# Altium schematic sheet Main.SchDoc
size A3; SheetNumber: 1
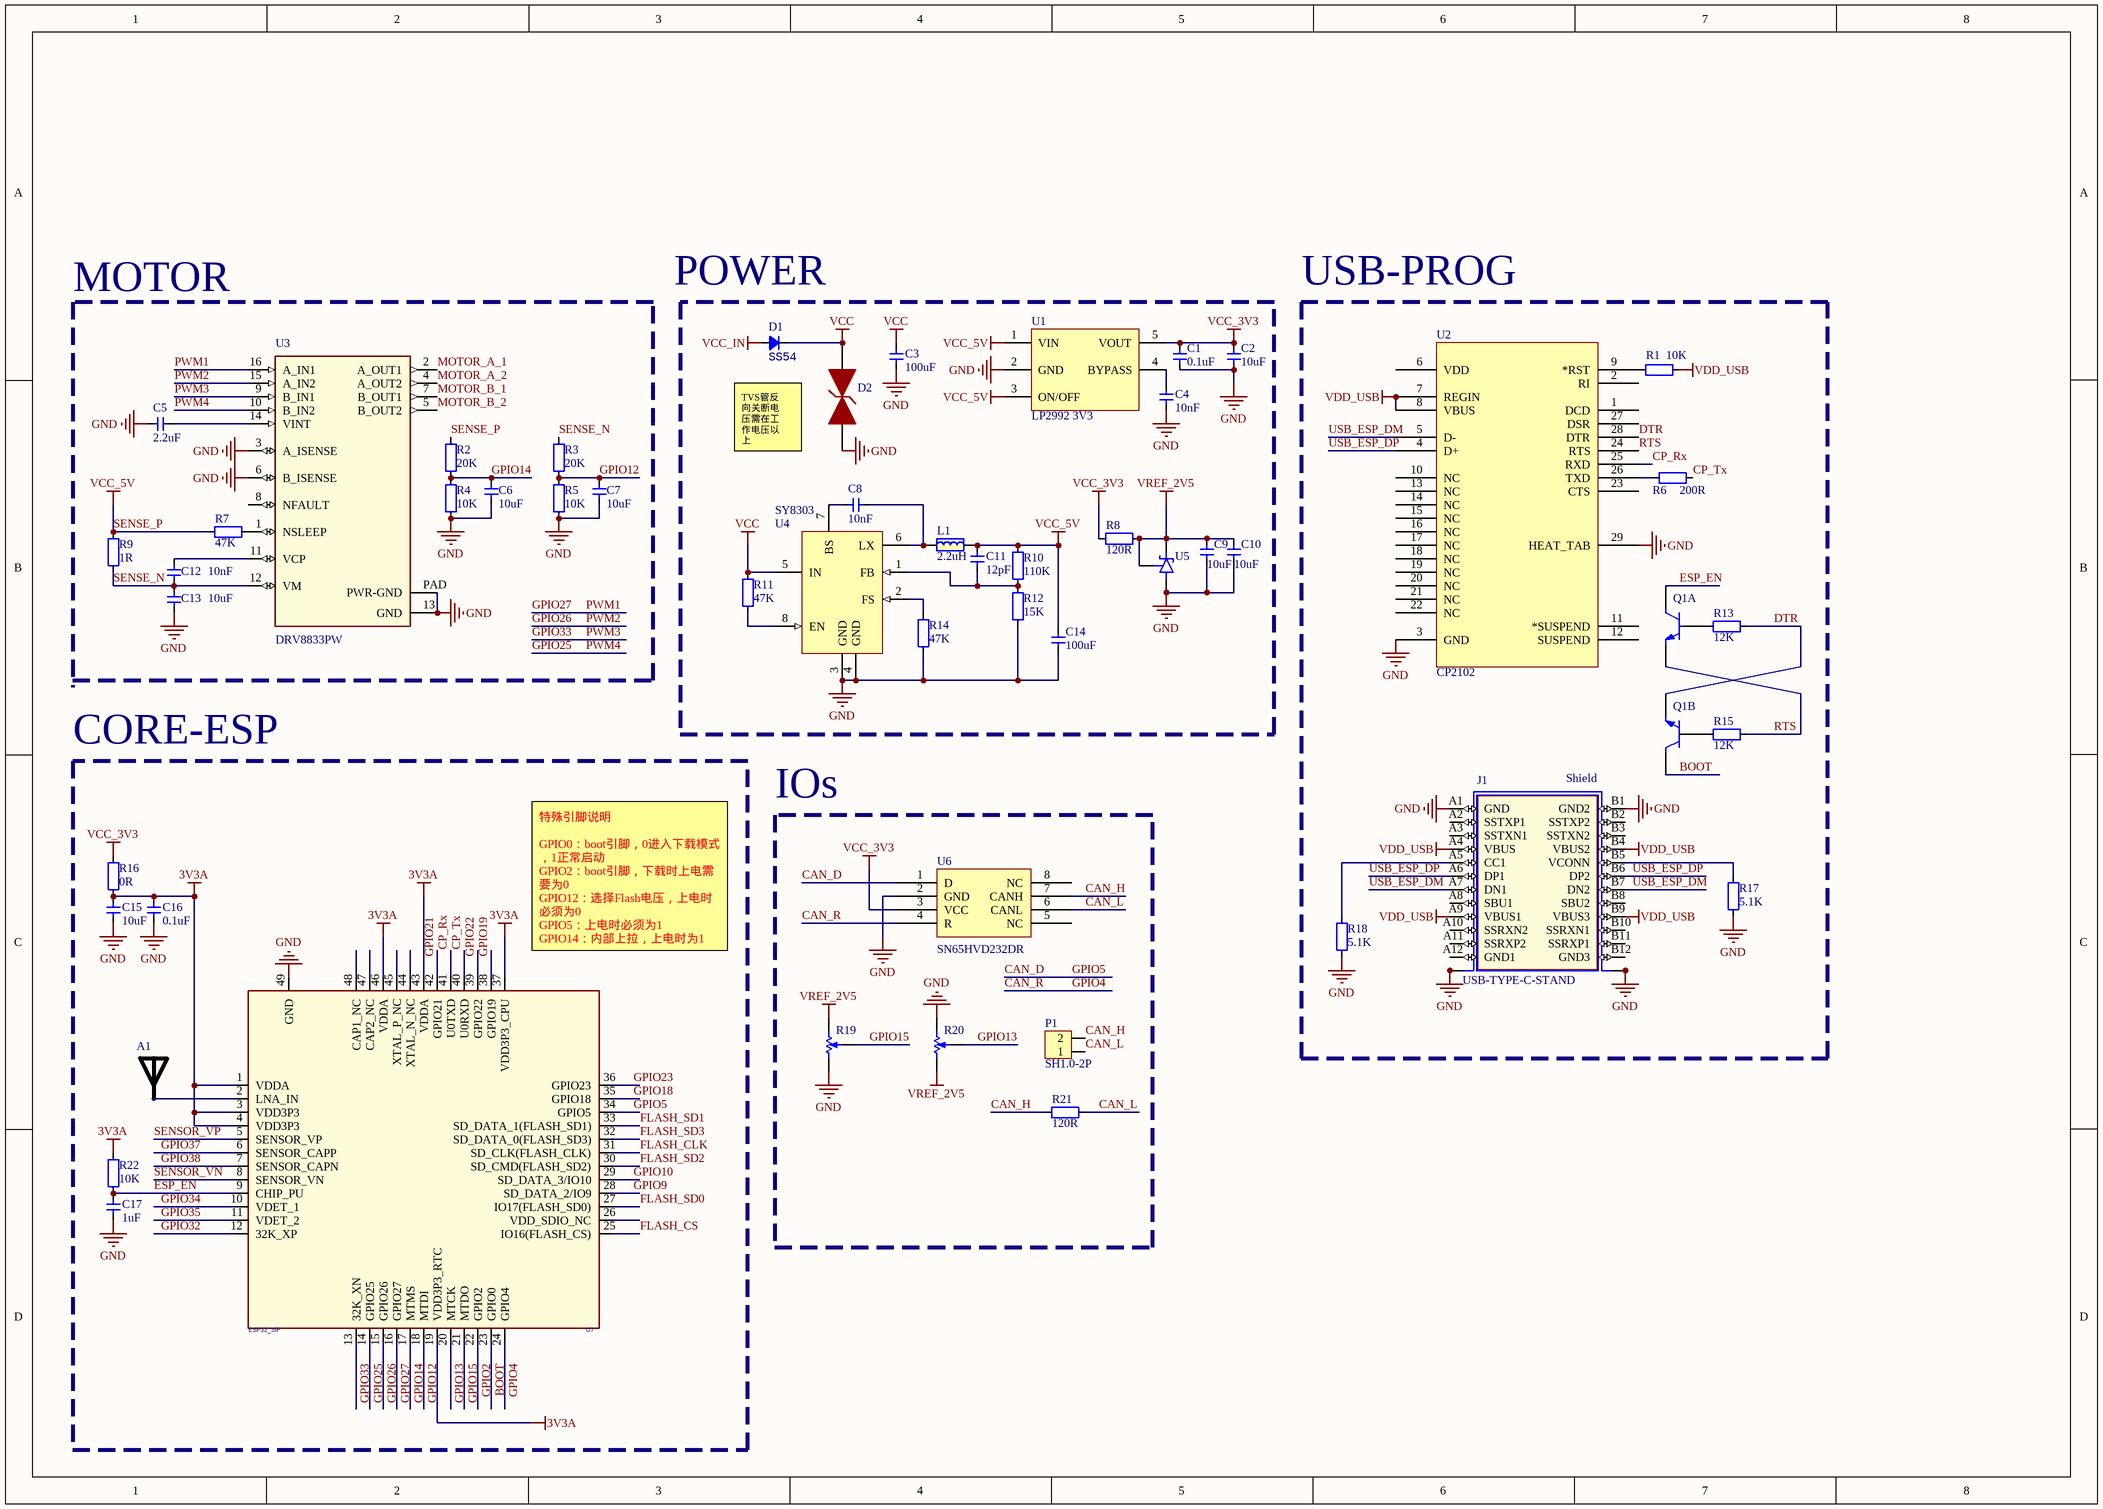
[diagram p0: Main.SchDoc]

## Parts
A1  RAINSUN  [ANT-Rainsun-AN5120]  (value not drawn)
C1  0.1uF  [CAP_0402]
C2  10uF  [CAP_0402]
C3  100uF  [1206-CAP]
C4  10nF  [CAP_0402]
C5  2.2uF  [CAP_0402]
C6  10uF  [CAP_0402]
C7  10uF  [CAP_0402]
C8  10nF  [CAP_0402]
C9  10uF  [CAP_0402]
C10  10uF  [CAP_0402]
C11  12pF  [CAP_0402]
C12  10nF  [CAP_0402]
C13  10uF  [CAP_0402]
C14  100uF  [CAP_0402]
C15  10uF  [CAP_0402]
C16  0.1uF  [CAP_0402]
C17  1uF  [CAP_0402]
D1  SS54  [DO-214AC]
D2  SMBJ28CA  [SMBJ-CA_MFG]  (value not drawn)
J1  USB-TYPE-C-STAND  [USB-TYPE-C-STAND]
L1  2.2uH  [IND_CD74]
P1  SH1.0-2P  [SH1.0-2P]
Q1  BC847BVC-7  [SOT563-6]  (value not drawn)  (parts A,B of 2)
R1  10K  [RES_0402]
R2  20K  [RES_0402]
R3  20K  [RES_0402]
R4  10K  [RES_0402]
R5  10K  [RES_0402]
R6  200R  [RES_0402]
R7  47K  [RES_0402]
R8  120R  [RES_0402]
R9  1R  [1206-RES]
R10  110K  [RES_0402]
R11  47K  [RES_0402]
R12  15K  [RES_0402]
R13  12K  [RES_0402]
R14  47K  [RES_0402]
R15  12K  [RES_0402]
R16  0R  [RES_0402]
R17  5.1K  [RES_0402]
R18  5.1K  [RES_0402]
R19  ALPS-角度传感器  [ALPS-角度传感器]  (value not drawn)
R20  ALPS-角度传感器  [ALPS-角度传感器]  (value not drawn)
R21  120R  [RES_0402]
R22  10K  [RES_0402]
U1  LP2992 3V3  [SOT23-5]
U2  CP2102  [QFN-28]
U3  DRV8833PW  [TSSOP-16]
U4  SY8303  [SOT23-8]
U5  TL431IDBZT  [SOT23-3]  (value not drawn)
U6  Manufacturer Part Number: SN65HVD232DR  [SO-8]  (hidden comment: SN65HVD232D)
U7  ESP32_SIP  [QFN-48_7X7]

## Blocks framed on the sheet
USB-PROG: J1 Q1 R1 R6 R13 R15 R17 R18 U2
CORE-ESP: A1 C15-C17 R16 R22 U7
IOs: P1 R19-R21 U6

## Nets
3V3A: C15.2 C16.2 R16.2 R22.1 U7.1(VDDA) U7.3(VDD3P3) U7.4(VDD3P3) U7.19(VDD3P3_RTC) U7.37(VDD3P3_CPU) U7.43(VDDA) U7.46(VDDA)
GND: C1.1 C2.1 C3.1 C4.1 C5.1 C6.1 C7.1 C9.1 C10.1 C13.1 C14.1 C15.1 C16.1 C17.2 D2.1 J1.A1(GND) J1.B1(GND2) J1.S1(SHIELD) J1.S2(SHIELD) J1.S3(SHIELD1) J1.S4(SHIELD1) R4.1 R5.1 R12.2 R14.2 R17.2 R18.2 R19.1(-) R20.3(+) U1.2(GND) U2.3(GND) U2.29(HEAT_TAB) U3.3(A_ISENSE) U3.6(B_ISENSE) U3.13(GND) U3.PAD(PWR-GND) U4.3(GND) U4.4(GND) U5.3(ANODE) U6.2(GND) U7.49(GND)
SENSE_P: C11.1 C14.2 L1.2 R2.2 R7.2 R9.2 R10.1 U1.1(VIN) U1.3(ON/OFF)  [also labelled VCC_5V]
VCC: C3.2 D1.2(K) D2.2 R11.1 U4.5(IN)
VCC_3V3: C1.2 C2.2 R8.1 R16.1 U1.5(VOUT) U6.3(VCC)
VCC_IN: D1.1(A)
VDD_USB: J1.A4(VBUS) J1.A9(VBUS1) J1.B4(VBUS2) J1.B9(VBUS3) R1.1 U2.7(REGIN) U2.8(VBUS)
VREF_2V5: C9.2 C10.2 R8.2 R19.3(+) R20.1(-) U5.1(CATHODE) U5.2(REF)
BOOT: Q1.3(C2) U7.23(GPIO0)
CAN_D: U6.1(D) U7.34(GPIO5)  [also labelled GPIO5]
CAN_H: P1.2 R21.2 U6.7(CANH)
CAN_L: P1.1 R21.1 U6.6(CANL)
CAN_R: U6.4(R) U7.24(GPIO4)  [also labelled GPIO4]
CP_Rx: U2.25(RXD) U7.41(U0TXD)
CP_Tx: R6.1 U7.40(U0RXD)
DTR: Q1.4(E2) R13.1 U2.28(DTR)
ESP_EN: C17.1 Q1.6(C1) R22.2 U7.9(CHIP_PU)
FLASH_CLK: U7.31(SD_CLK(FLASH_CLK))
FLASH_CS: U7.25(IO16(FLASH_CS))
FLASH_SD0: U7.27(IO17(FLASH_SD0))
FLASH_SD1: U7.33(SD_DATA_1(FLASH_SD1))
FLASH_SD2: U7.30(SD_CMD(FLASH_SD2))
FLASH_SD3: U7.32(SD_DATA_0(FLASH_SD3))
GPIO2: U7.22(GPIO2)
GPIO9: U7.28(SD_DATA_2/IO9)
GPIO10: U7.29(SD_DATA_3/IO10)
GPIO12: C7.2 R3.1 R5.2 U7.18(MTDI)
GPIO13: R20.2(W) U7.20(MTCK)
GPIO14: C6.2 R2.1 R4.2 U7.17(MTMS)
GPIO15: R19.2(W) U7.21(MTDO)
GPIO18: U7.35(GPIO18)
GPIO19: U7.38(GPIO19)
GPIO21: U7.42(GPIO21)
GPIO22: U7.39(GPIO22)
GPIO23: U7.36(GPIO23)
GPIO25: U3.10(B_IN2) U7.14(GPIO25)  [also labelled PWM4]
GPIO26: U3.15(A_IN2) U7.15(GPIO26)  [also labelled PWM2]
GPIO27: U3.16(A_IN1) U7.16(GPIO27)  [also labelled PWM1]
GPIO32: U7.12(32K_XP)
GPIO33: U3.9(B_IN1) U7.13(32K_XN)  [also labelled PWM3]
GPIO34: U7.10(VDET_1)
GPIO35: U7.11(VDET_2)
GPIO37: U7.6(SENSOR_CAPP)
GPIO38: U7.7(SENSOR_CAPN)
MOTOR_A_1: U3.2(A_OUT1)
MOTOR_A_2: U3.4(A_OUT2)
MOTOR_B_1: U3.7(B_OUT1)
MOTOR_B_2: U3.5(B_OUT2)
RTS: Q1.1(E1) R15.1 U2.24(RTS)
SENSE_N: C12.1 C13.2 R3.2 R9.1 U3.12(VM)
SENSOR_VN: U7.8(SENSOR_VN)
SENSOR_VP: U7.5(SENSOR_VP)
USB_ESP_DM: J1.A7(DN1) J1.B7(DN2) U2.5(D-)
USB_ESP_DP: J1.A6(DP1) J1.B6(DP2) U2.4(D+)
NetA1_1: A1.1 U7.2(LNA_IN)
NetC4_2: C4.2 U1.4(BYPASS)
NetC5_2: C5.2 U3.14(VINT)
NetC8_1: C8.1 L1.1 U4.6(LX)
NetC8_2: C8.2 U4.7(BS)
NetC11_2: C11.2 R10.2 R12.1 U4.1(FB)
NetC12_2: C12.2 U3.11(VCP)
NetJ1_A5: J1.A5(CC1) R18.1
NetJ1_B5: J1.B5(VCONN) R17.1
NetQ1_2: Q1.2(B1) R13.2
NetQ1_5: Q1.5(B2) R15.2
NetR1_2: R1.2 U2.9(*RST)
NetR6_2: R6.2 U2.26(TXD)
NetR7_1: R7.1 U3.1(NSLEEP)
NetR11_2: R11.2 U4.8(EN)
NetR14_1: R14.1 U4.2(FS)

Not connected (* = marked no-connect by the designer): J1 A2(SSTXP1) A3(SSTXN1) A8(SBU1) A10(SSRXN2) A11(SSRXP2) A12(GND1) B2(SSTXP2) B3(SSTXN2) B8(SBU2) B10(SSRXN1) B11(SSRXP1) B12(GND3); U2 1(DCD) 2(RI) 6(VDD) 10(NC) 11(*SUSPEND) 12(SUSPEND) 13(NC) 14(NC) 15(NC) 16(NC) 17(NC) 18(NC) 19(NC) 20(NC) 21(NC) 22(NC) 23(CTS) 27(DSR); U3 8(NFAULT); U6 5(NC) 8(NC); U7 26(VDD_SDIO_NC) 44(XTAL_N_NC) 45(XTAL_P_NC) 47(CAP2_NC) 48(CAP1_NC)

## Notes on the sheet
- MOTOR
- (near D1) POWER
- TVS管反
  向关断电
  压需在工
  作电压以
  上
- (near U7) 特殊引脚说明
  GPIO0：boot引脚，0进入下载模式，1正常启动
  GPIO2：boot引脚，下载时上电需要为0
  GPIO12：选择Flash电压，上电时必须为0
  GPIO5：上电时必须为1
  GPIO14：内部上拉，上电时为1
  GPIO15：上电时必须为1
- (in symbol USB-TYPE-C-STAND) Shield

## Library data of the parts
A1 = ANT-Rainsun-AP5120
C1 C2 C4-C17 = 电容-0402: Capacitor; Value: 0.1u
C3 = 电容-1206: Capacitor; Value: 0.1u
D1 = Diode_SMA: Diode; Type: SMA; Value: SS54
J1 = USB-TYPE-C-STAND: MP: 632722110112; MF: Wurth Electronics; SnapEDA_Link: https://www.snapeda.com/parts/632722110112/Wurth%20Electronics%20Inc./view-part/3596593/?ref=snap; Price: None; DigiKey-Purchase-URL: https://snapeda.com/shop?store=DigiKey&id=3596593; Package: None; Availability: Unavailable; Value: *
L1 = 电感
R1-R8 R10-R18 R21 R22 = 电阻-0402: Resistor; Value: 22R
R9 = 电阻-1206: Resistor; Value: 22R
U1 = LP2992: LDO
U2 = CP2102: USB转TTL; PART DESC: SINGLE-CHIP USB TO UART BRIDGE, QFN28, RoHS.; MFG #1: SILICON LABS; PART NUMBER: CP2102; Value: Value; RefDes: RefDes; Type: DEV
U4 = SY8303: DC-DC; PartNumber: LT3469ETS8#TRMPBF; Manufacturer: Linear Technology; Number of Outputs: 1; Packing: Mini Tape and Reel; ComponentLink2Description: Datasheet; ComponentLink3Description: Package Specification; Mounting Technology: Surface Mount; ComponentLink3URL: http://cds.linear.com/docs/en/packaging/SOT_8_05-08-1637.pdf; ComponentLink1URL: http://www.linear.com/; ComponentLink1Description: Manufacturer URL; Code_JEDEC: MO-193; PackageVersion: Rev. A, 08/2010; PackageReference: TS8-8; PackageDescription: 8-Pin Plastic TSOT-23, Body 2.9 x 1.63 mm, Pitch 0.65 mm; ComponentLink2URL: http://cds.linear.com/docs/en/datasheet/3469f.pdf; RoHS: TRUE
U5 = TL431IDBZT: Adjustable precision shunt regulator 3-SOT-23 -40 to 85; MF: Texas Instruments; Price: None; Package: SOT-23-3 Texas Instruments; Check_prices: https://www.snapeda.com/parts/TL431IDBZT/Texas%20Instruments/view-part/1206577/?ref=eda; Availability: Warning; MP: TL431IDBZT; Value: *; SnapEDA_Link: https://www.snapeda.com/parts/TL431IDBZT/Texas%20Instruments/view-part/1206577/?ref=snap; Purchase-URL: https://pricing.snapeda.com/search/part/TL431IDBZT/?ref=eda
U6 = SN65HVD232D: Manufacturer: Texas Instruments; Protocol: CAN; Number of Drivers/Receivers: 1/1; Duplex: Half; Data Rate: 1Mbps; Voltage - Supply: 3 V ~ 3.6 V; Supplier 1: Digi-Key; Supplier Part Number 1: 296-26344-2-ND; RoHS: RoHS Compliant; Category: Integrated Circuits (ICs); Stock: 5000; Pricing 1: 2500=0.84375 (USD); Packaging: Tape & Reel (TR); Part Status: Active; Type: Transceiver; Operating Temperature: -40°C ~ 85°C; Mounting Type: Surface Mount; Package / Case: 8-SOIC (0.154", 3.90mm Width); Supplier Device Package: 8-SOIC; ComponentLink1URL: http://www.ti.com/lit/ds/symlink/sn65hvd230.pdf; ComponentLink1Description: http://www.ti.com/lit/ds/symlink/sn65hvd230.pdf; Supplier 2: Digi-Key; Supplier Part Number 2: 296-26344-1-ND; Pricing 2: 1=2.05, 10=1.842, 100=1.4809, 500=1.21668, 1000=1.00811 (USD)
U7 = ESP32-PICO
R19 R20 = ALPS-角度传感器: Published: 17-Dec-2003; DatasheetVersion: Oct-2003; PackageReference: POT4MM-2; Publisher: Altium Limited; PackageDescription: Square Trimming Potentiometer; ComponentLink1Description: Manufacturer Link; ComponentLink1URL: http://bourns.com/2/search.html
U3 = DRV8833PW: SnapEDA_Link: https://www.snapeda.com/parts/DRV8833PW/Texas%20Instruments/view-part/507725/?ref=snap; Value: *